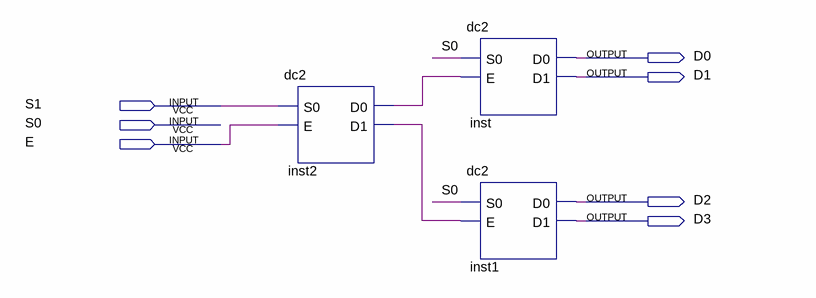
[diagram p0: schematic sheet]
// Quartus schematic dc4.bdf as structural Verilog: 3 symbols, 7 pins
module dc4 (
  input  S1,
  input  S0,
  input  E,
  output D0,
  output D1,
  output D2,
  output D3
);

  wire inst2_d0, inst2_d1;

  dc2 inst2 (.S0(S1), .E(E), .D0(inst2_d0), .D1(inst2_d1));
  dc2 inst (.S0(S0), .E(inst2_d0), .D0(D0), .D1(D1));
  dc2 inst1 (.S0(S0), .E(inst2_d1), .D0(D2), .D1(D3));
endmodule
